# EAGLE schematic Low-Frequency-LC-Oscillator (EAGLE 7.6.0)
Low-Frequency LC Oscillator Basically a Hartley oscillator using a triple-emitter follower, this oscillator can be used at audio and low radio frequencies. The frequency is given by: At 1 kHz, typically C would be 4.7uF tantalums, but this is only a guide as to convenient values to use. http://www.next.gr/oscillators/sine-wave/low-frequency-lc-oscillator-l14396.html
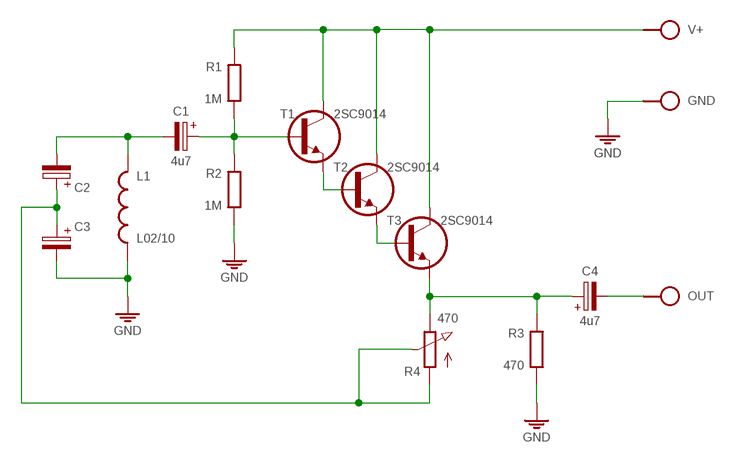
[diagram p0: schematic, sheet 1]

## Parts
C1  4u7  CPOLE2,5-3  [E2,5-3]
C2  CPOLE2.5-5  [E2,5-5]
C3  CPOLE2.5-5  [E2,5-5]
C4  4u7  CPOLE2,5-3  [E2,5-3]
GND  SPAD  [SPAD]
L1  L02/10  [L-03/10V]
OUT  SPAD  [SPAD]
R1  1M  R0204/10  [0204/10]
R2  1M  R0204/10  [0204/10]
R3  470  R0204/10  [0204/10]
R4  470  POT  [POT]
T1  2SC9014  [TO92-EBC]
T2  2SC9014  [TO92-EBC]
T3  2SC9014  [TO92-EBC]
V+  SPAD  [SPAD]

## Nets
GND: C3.- GND.1 L1.2 R2.1 R3.1
N$1: R1.2 T1.C T2.C T3.C V+.1
N$2: C4.- OUT.1
N$5: C4.+ R3.2 R4.3(E) T3.E
N$6: T1.E T2.B
N$7: T2.E T3.B
N$8: C1.- C2.- L1.1
N$9: C1.+ R1.1 R2.2 T1.B
N$10: C2.+ C3.+ R4.1(A) R4.2(S)

## Library data of the parts
C1-C4 = c:CPOL: POLARIZED CAPACITOR, European symbol
GND OUT V+ = pad:SPAD
L1 = r:L
R1-R3 = r:R: RESISTOR, European symbol
R4 = r:POT
T1-T3 = t:2SC9014